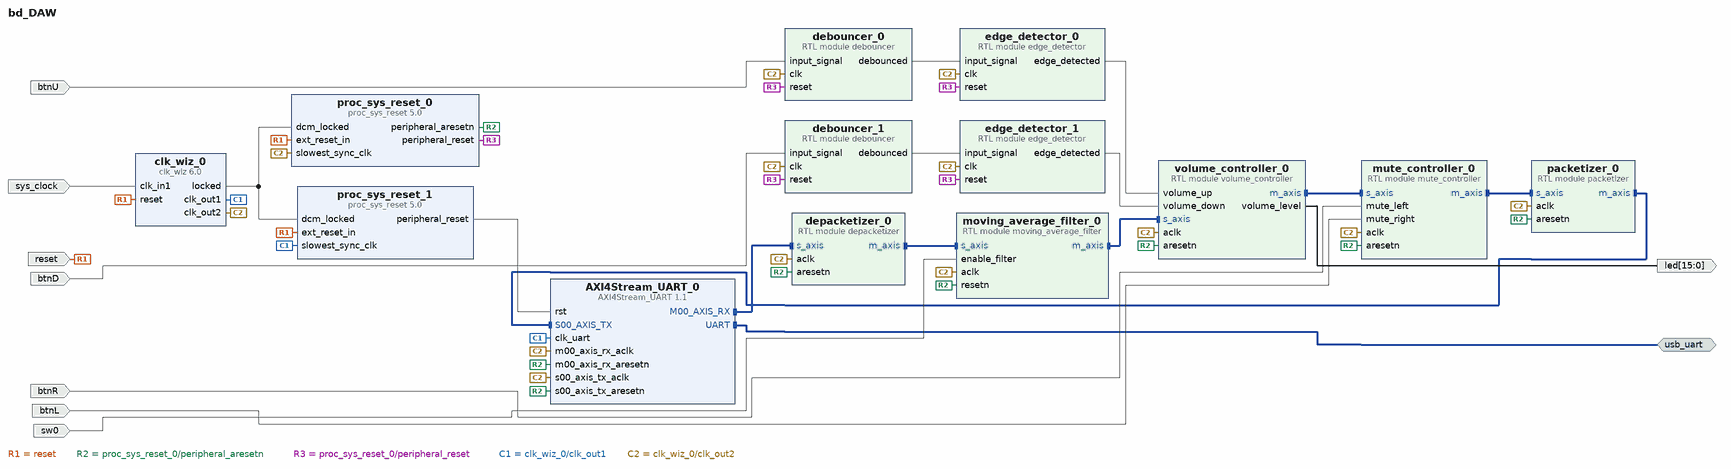
[diagram p0: block diagram of the top level]
# Vivado block design bd_DAW, xc7a35tcpg236-1, Vivado 2020.2
create_bd_design bd_DAW

create_bd_intf_port -mode Master -vlnv xilinx.com:interface:uart_rtl:1.0 usb_uart
create_bd_port -dir I -type clk sys_clock
set_property -dict {CONFIG.FREQ_HZ 100000000 CONFIG.PHASE 0.000} [get_bd_ports sys_clock]
create_bd_port -dir I -type rst reset
set_property -dict {CONFIG.POLARITY ACTIVE_HIGH} [get_bd_ports reset]
create_bd_port -dir I btnR
create_bd_port -dir I btnL
create_bd_port -dir I btnU
create_bd_port -dir I btnD
create_bd_port -dir O -from 15 -to 0 led
create_bd_port -dir I sw0

create_bd_cell -type ip -vlnv xilinx.com:ip:clk_wiz:6.0 clk_wiz_0
set_property -dict [list \
  CONFIG.CLKOUT1_DRIVES BUFG \
  CONFIG.CLKOUT1_JITTER 129.006 \
  CONFIG.CLKOUT1_PHASE_ERROR 152.899 \
  CONFIG.CLKOUT1_REQUESTED_OUT_FREQ 64 \
  CONFIG.CLKOUT2_DRIVES BUFG \
  CONFIG.CLKOUT2_JITTER 106.329 \
  CONFIG.CLKOUT2_PHASE_ERROR 152.899 \
  CONFIG.CLKOUT2_REQUESTED_OUT_FREQ 250 \
  CONFIG.CLKOUT2_USED true \
  CONFIG.CLKOUT3_DRIVES BUFG \
  CONFIG.CLKOUT4_DRIVES BUFG \
  CONFIG.CLKOUT5_DRIVES BUFG \
  CONFIG.CLKOUT6_DRIVES BUFG \
  CONFIG.CLKOUT7_DRIVES BUFG \
  CONFIG.CLK_IN1_BOARD_INTERFACE sys_clock \
  CONFIG.MMCM_BANDWIDTH OPTIMIZED \
  CONFIG.MMCM_CLKFBOUT_MULT_F 46 \
  CONFIG.MMCM_CLKOUT0_DIVIDE_F 24 \
  CONFIG.MMCM_CLKOUT1_DIVIDE 6 \
  CONFIG.MMCM_COMPENSATION ZHOLD \
  CONFIG.MMCM_DIVCLK_DIVIDE 3 \
  CONFIG.NUM_OUT_CLKS 2 \
  CONFIG.PRIMITIVE PLL \
  CONFIG.RESET_BOARD_INTERFACE reset \
  CONFIG.USE_BOARD_FLOW true \
] [get_bd_cells clk_wiz_0]
create_bd_cell -type ip -vlnv xilinx.com:ip:proc_sys_reset:5.0 proc_sys_reset_0
create_bd_cell -type ip -vlnv xilinx.com:ip:proc_sys_reset:5.0 proc_sys_reset_1
create_bd_cell -type ip -vlnv DigiLAB:ip:AXI4Stream_UART:1.1 AXI4Stream_UART_0
set_property -dict [list \
  CONFIG.UART_BAUD_RATE 2000000 \
  CONFIG.UART_BOARD_INTERFACE usb_uart \
  CONFIG.USE_BOARD_FLOW true \
] [get_bd_cells AXI4Stream_UART_0]
create_bd_cell -type module -reference packetizer packetizer_0
create_bd_cell -type module -reference depacketizer depacketizer_0
create_bd_cell -type module -reference edge_detector edge_detector_0
create_bd_cell -type module -reference debouncer debouncer_0
create_bd_cell -type module -reference edge_detector edge_detector_1
create_bd_cell -type module -reference debouncer debouncer_1
create_bd_cell -type module -reference volume_controller volume_controller_0
create_bd_cell -type module -reference mute_controller mute_controller_0
create_bd_cell -type module -reference moving_average_filter moving_average_filter_0

# ---- connections ----

connect_bd_intf_net [get_bd_intf_pins moving_average_filter_0/m_axis] [get_bd_intf_pins volume_controller_0/s_axis]
connect_bd_intf_net [get_bd_intf_ports usb_uart] [get_bd_intf_pins AXI4Stream_UART_0/UART]
connect_bd_intf_net [get_bd_intf_pins AXI4Stream_UART_0/S00_AXIS_TX] [get_bd_intf_pins packetizer_0/m_axis]
connect_bd_intf_net [get_bd_intf_pins mute_controller_0/m_axis] [get_bd_intf_pins packetizer_0/s_axis]
connect_bd_intf_net [get_bd_intf_pins volume_controller_0/m_axis] [get_bd_intf_pins mute_controller_0/s_axis]
connect_bd_intf_net [get_bd_intf_pins AXI4Stream_UART_0/M00_AXIS_RX] [get_bd_intf_pins depacketizer_0/s_axis]
connect_bd_intf_net [get_bd_intf_pins depacketizer_0/m_axis] [get_bd_intf_pins moving_average_filter_0/s_axis]
connect_bd_net [get_bd_ports sys_clock] [get_bd_pins clk_wiz_0/clk_in1]
connect_bd_net [get_bd_ports reset] \
  [get_bd_pins clk_wiz_0/reset] [get_bd_pins proc_sys_reset_0/ext_reset_in] [get_bd_pins proc_sys_reset_1/ext_reset_in]
connect_bd_net [get_bd_pins clk_wiz_0/locked] [get_bd_pins proc_sys_reset_0/dcm_locked] [get_bd_pins proc_sys_reset_1/dcm_locked]
connect_bd_net [get_bd_pins proc_sys_reset_1/peripheral_reset] [get_bd_pins AXI4Stream_UART_0/rst]
connect_bd_net [get_bd_pins proc_sys_reset_0/peripheral_aresetn] \
  [get_bd_pins AXI4Stream_UART_0/s00_axis_tx_aresetn] [get_bd_pins AXI4Stream_UART_0/m00_axis_rx_aresetn] \
  [get_bd_pins packetizer_0/aresetn] [get_bd_pins depacketizer_0/aresetn] [get_bd_pins volume_controller_0/aresetn] \
  [get_bd_pins mute_controller_0/aresetn] [get_bd_pins moving_average_filter_0/resetn]
connect_bd_net [get_bd_pins debouncer_0/debounced] [get_bd_pins edge_detector_0/input_signal]
connect_bd_net [get_bd_pins debouncer_1/debounced] [get_bd_pins edge_detector_1/input_signal]
connect_bd_net [get_bd_pins proc_sys_reset_0/peripheral_reset] \
  [get_bd_pins debouncer_1/reset] [get_bd_pins edge_detector_1/reset] [get_bd_pins debouncer_0/reset] \
  [get_bd_pins edge_detector_0/reset]
connect_bd_net [get_bd_ports btnU] [get_bd_pins debouncer_0/input_signal]
connect_bd_net [get_bd_ports btnD] [get_bd_pins debouncer_1/input_signal]
connect_bd_net [get_bd_pins edge_detector_1/edge_detected] [get_bd_pins volume_controller_0/volume_down]
connect_bd_net [get_bd_pins edge_detector_0/edge_detected] [get_bd_pins volume_controller_0/volume_up]
connect_bd_net [get_bd_pins volume_controller_0/volume_level] [get_bd_ports led]
connect_bd_net [get_bd_ports btnR] [get_bd_pins mute_controller_0/mute_left]
connect_bd_net [get_bd_ports btnL] [get_bd_pins mute_controller_0/mute_right]
connect_bd_net [get_bd_pins clk_wiz_0/clk_out1] [get_bd_pins proc_sys_reset_1/slowest_sync_clk] [get_bd_pins AXI4Stream_UART_0/clk_uart]
connect_bd_net [get_bd_pins clk_wiz_0/clk_out2] \
  [get_bd_pins depacketizer_0/aclk] [get_bd_pins AXI4Stream_UART_0/m00_axis_rx_aclk] \
  [get_bd_pins AXI4Stream_UART_0/s00_axis_tx_aclk] [get_bd_pins packetizer_0/aclk] [get_bd_pins debouncer_0/clk] \
  [get_bd_pins debouncer_1/clk] [get_bd_pins edge_detector_0/clk] [get_bd_pins edge_detector_1/clk] \
  [get_bd_pins proc_sys_reset_0/slowest_sync_clk] [get_bd_pins volume_controller_0/aclk] [get_bd_pins mute_controller_0/aclk] \
  [get_bd_pins moving_average_filter_0/aclk]
connect_bd_net -net sw0_1 [get_bd_ports sw0] [get_bd_pins moving_average_filter_0/enable_filter]

validate_bd_design
save_bd_design
